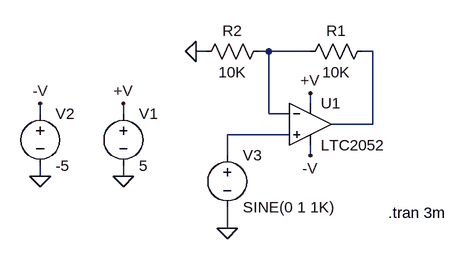
[diagram p0: schematic 2052.asc]
2052.asc, the LTspice schematic file:
Version 4
SHEET 1 896 680
WIRE -48 -16 -64 -16
WIRE 48 -16 32 -16
WIRE 112 -16 48 -16
WIRE 208 -16 192 -16
WIRE 112 64 112 48
WIRE -304 80 -304 64
WIRE -176 80 -176 64
WIRE 48 80 48 -16
WIRE 80 80 48 80
WIRE 208 96 208 -16
WIRE 208 96 144 96
WIRE 80 112 -16 112
WIRE -16 144 -16 112
WIRE 112 144 112 128
WIRE -304 176 -304 160
WIRE -176 176 -176 160
WIRE -16 256 -16 224
FLAG -176 176 0
FLAG 112 48 +V
FLAG -176 64 +V
FLAG 112 144 -V
FLAG -304 176 0
FLAG -304 64 -V
FLAG -16 256 0
FLAG -64 -16 0
SYMBOL voltage -176 64 R0
SYMATTR InstName V1
SYMATTR Value 5
SYMBOL voltage -304 64 R0
SYMATTR InstName V2
SYMATTR Value -5
SYMBOL voltage -16 128 R0
SYMATTR InstName V3
SYMATTR Value SINE(0 1 1K)
SYMBOL res 208 -32 R90
WINDOW 0 0 56 VBottom 2
WINDOW 3 32 56 VTop 2
SYMATTR InstName R1
SYMATTR Value 10K
SYMBOL res 48 -32 R90
WINDOW 0 0 56 VBottom 2
WINDOW 3 32 56 VTop 2
SYMATTR InstName R2
SYMATTR Value 10K
SYMBOL opamps\\LTC2052 112 96 R0
SYMATTR InstName U1
TEXT 232 232 Left 2 !.tran 3m

The netlist it stands for:
* 2052.asc
V1 +V 0 5
V2 -V 0 -5
V3 N003 0 SINE(0 1 1K)
R1 N002 N001 10K
R2 N001 0 10K
* U1: LTC2052 (symbol opamps\LTC2052 not available, pins judged from their places): In+=N003 In-=N001 V+=+V V-=-V OUT=N002
.tran 3m
.backanno
.end